# EasyEDA Pro project ProProject_STM32F407IGT6_2024-02-27.epro, schematic Schematic4
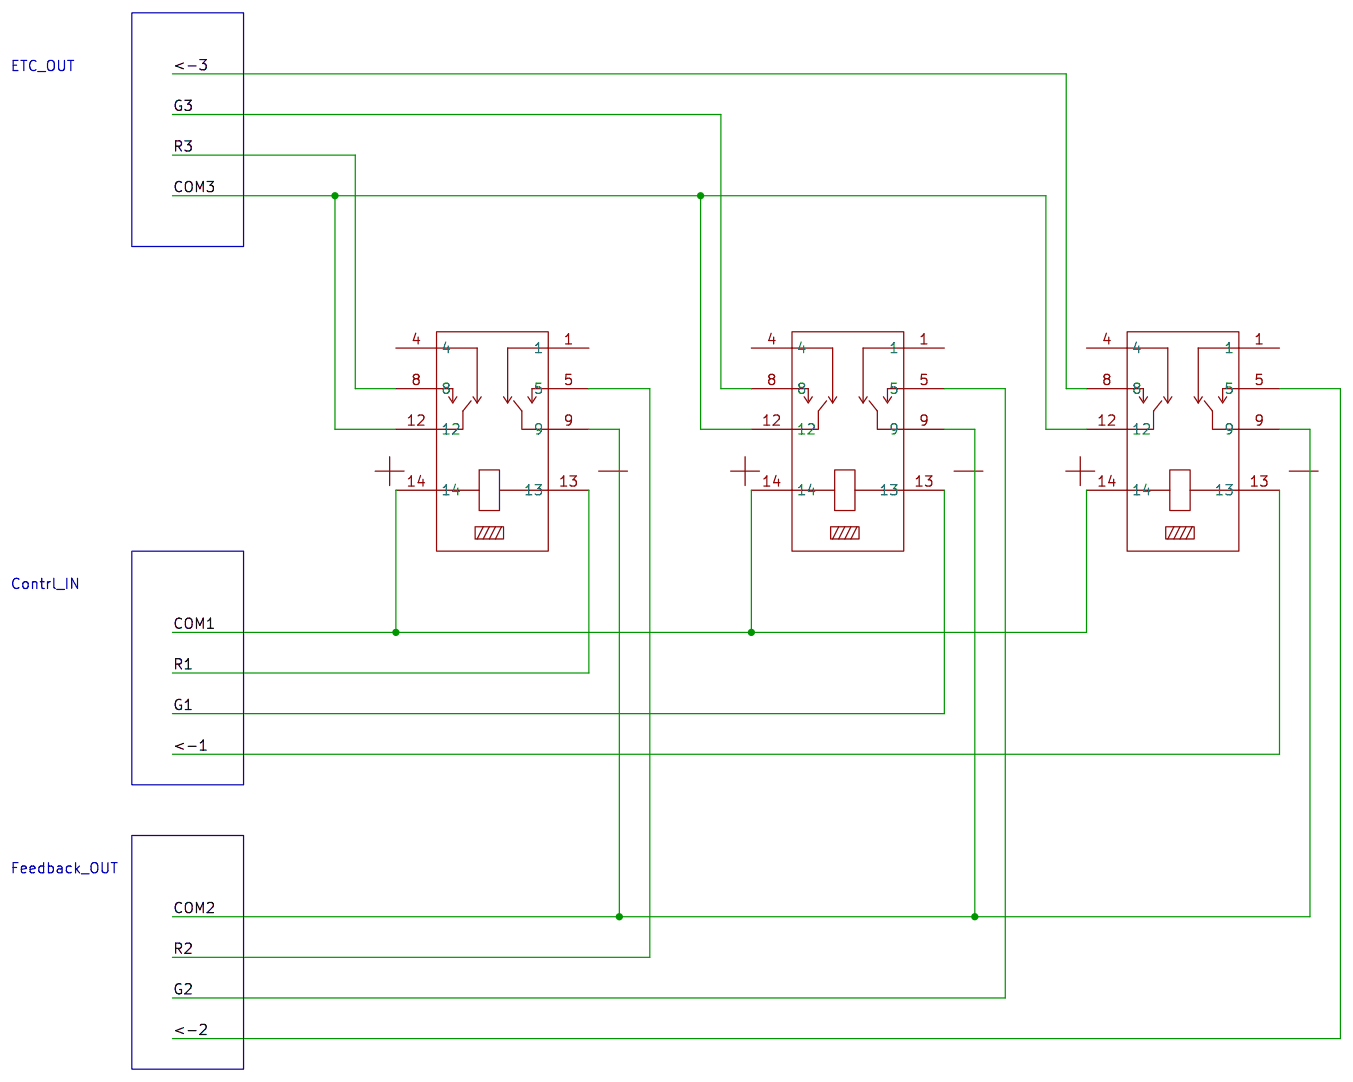
[diagram p1: schematic sheet]

## Parts
RLY1  G2R-2 DC24  [RELAY-TH_G2R-2]
RLY2  G2R-2 DC24  [RELAY-TH_G2R-2]
RLY3  G2R-2 DC24  [RELAY-TH_G2R-2]

## Library data of the parts
RLY1-RLY3 = G2R-2 DC24: 线圈电压:-;触点形式:-;触点容量(电阻负载):-;最大切换电压:-;最大切换电流:-;; Supplier: LCSC; Manufacturer: OMRON(欧姆龙); Supplier Part: C14539; JLCPCB Part Class: 扩展库; Supplier Footprint: DIP,12.7x28.8mm; Datasheet: https://atta.szlcsc.com/upload/public/pdf/source/20191212/C469145_E1931BC9B780906BEC6A7579775E2C5A.pdf

## Nets
<-1: RLY3.13
<-2: RLY3.5
<-3: RLY3.8
COM1: RLY1.14 RLY2.14 RLY3.14
COM2: RLY1.9 RLY2.9 RLY3.9
COM3: RLY1.12 RLY2.12 RLY3.12
G1: RLY2.13
G2: RLY2.5
G3: RLY2.8
R1: RLY1.13
R2: RLY1.5
R3: RLY1.8

Not connected (* = marked no-connect by the designer): RLY1 1 4; RLY2 1 4; RLY3 1 4

## Notes on the sheet
- ETC_OUT
- Contrl_IN
- Feedback_OUT
